# Altium schematic sheet 6-E2p&RTC.SchDoc
size A4
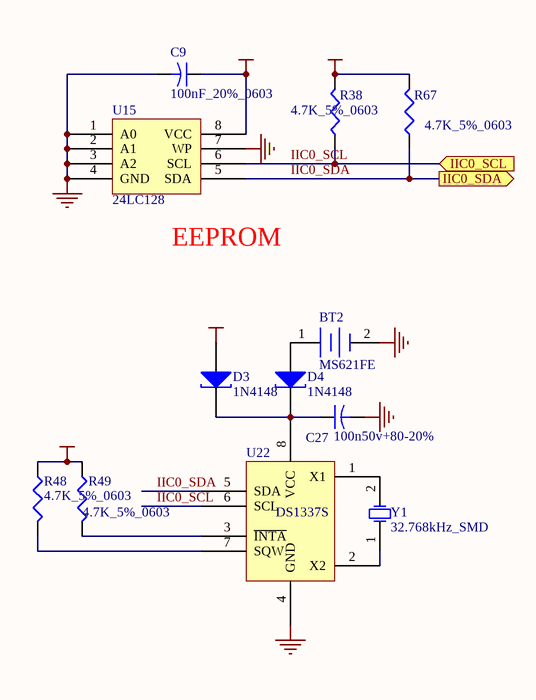
[diagram p0: 6-E2p&RTC.SchDoc]

## Parts
BT2  MS621FE  [BATT_BAK]
C9  100nF_20%_0603  [C1608-0603]
C27  value 100n50v+80-20%  [C1608-0603]  (hidden comment: Cap2)
D3  1N4148  [LED0805]
D4  1N4148  [LED0805]
R38  4.7K_5%_0603  [C1608-0603]
R48  4.7K_5%_0603  [C1608-0603]
R49  4.7K_5%_0603  [C1608-0603]
R67  4.7K_5%_0603  [C1608-0603]
U15  24LC128  [8s1]
U22  DS1337S  [SO-8]
Y1  32.768kHz_SMD  [XTAL-3216]

## Ports
IIC0_SCL (in), IIC0_SDA (out)

## Nets
GND: BT2.2(-) C9.2 C27.2 U15.1(A0) U15.2(A1) U15.3(A2) U15.4(GND) U15.7(WP) U22.4(GND)
VCC_3V3: C9.1 D3.1(A) R38.2 R48.1 R49.1 R67.2 U15.8(VCC)
IIC0_SCL: R38.1 U15.6(SCL) U22.6(SCL) ; port IIC0_SCL
IIC0_SDA: R67.1 U15.5(SDA) U22.5(SDA) ; port IIC0_SDA
NetBT2_1: BT2.1(+) D4.1(A)
NetC27_1: C27.1 D3.2(K) D4.2(K) U22.8(VCC)
NetR48_2: R48.2 U22.7(SQW)
NetR49_2: R49.2 U22.3(~{INTA})
NetU22_1: U22.1(X1) Y1.2(OSC2)
NetU22_2: U22.2(X2) Y1.1(OSC1)

## Notes on the sheet
- (near U15) EEPROM

## Library data of the parts
BT2 = Battery: Multicell Battery; Published: 24-Mar-1999; Revision: July-2002: Re-released for DXP Platform.; Publisher: Altium Limited
C9 = Cap2: Capacitor; Value: 0.1uF 0603; Published: 23-Sep-2002; Publisher: Altium Limited
C27 = Cap2: Capacitor; Published: 23-Sep-2002; Publisher: Altium Limited
D3 D4 = D Tunnel1: Tunnel Diode - RLC Model; Published: 8-Jun-2000; LatestRevisionDate: 17-Jul-2002; LatestRevisionNote: Re-released for DXP Platform.; Publisher: Altium Limited
R38 R48 R49 R67 = Res3: Resistor; Value: 1K%5 0603; Published: 8-Jun-2000; Revision: July-2002: Re-released for DXP Platform.; Publisher: Altium Limited
U15 = 24LC02: IC
Y1 = XTAL: Crystal Oscillator; Published: 8-Jun-2000; Revision: July-2002: Re-released for DXP Platform.; Publisher: Altium Limited